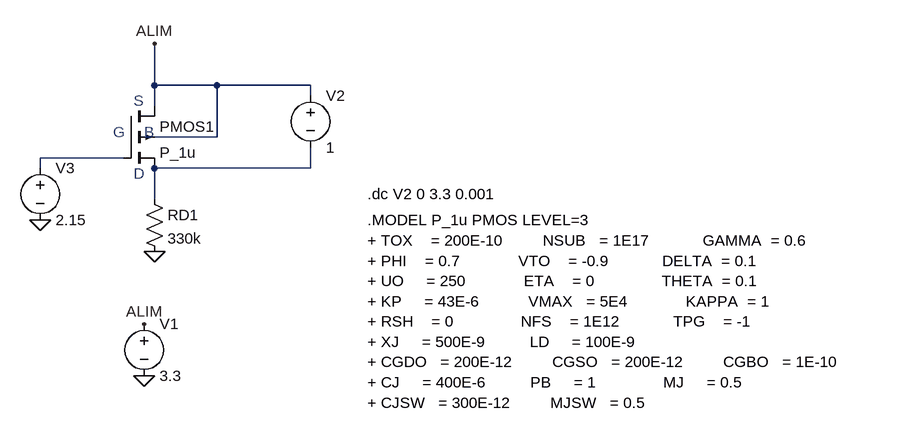
[diagram p0: schematic Simulation_gd.asc]
Simulation_gd.asc, the LTspice schematic file:
Version 4
SHEET 1 880 680
WIRE -336 -80 -336 -144
WIRE -240 -80 -336 -80
WIRE -96 -80 -240 -80
WIRE -96 -64 -96 -80
WIRE -336 -48 -336 -80
WIRE -240 0 -240 -80
WIRE -240 0 -336 0
WIRE -384 32 -512 32
WIRE -512 48 -512 32
WIRE -96 48 -96 16
WIRE -96 48 -336 48
WIRE -336 96 -336 48
FLAG -352 288 ALIM
FLAG -352 368 0
FLAG -336 176 0
FLAG -336 -144 ALIM
FLAG -512 128 0
SYMBOL voltage -352 272 R0
WINDOW 123 0 0 Left 0
WINDOW 39 0 0 Left 0
SYMATTR InstName V1
SYMATTR Value 3.3
SYMBOL pmos4 -384 -48 R0
SYMATTR InstName PMOS1
SYMATTR Value P_1u
SYMATTR Value2 l=1u w=2.5u
SYMBOL res -352 80 R0
SYMATTR InstName RD1
SYMATTR Value 330k
SYMBOL voltage -96 -80 R0
SYMATTR InstName V2
SYMATTR Value 1
SYMBOL voltage -512 32 R0
WINDOW 123 0 0 Left 0
WINDOW 39 0 0 Left 0
SYMATTR InstName V3
SYMATTR Value 2.15
TEXT -8 88 Left 2 !.dc V2 0 3.3 0.001
TEXT -368 -56 Left 2 ;S
TEXT -400 -8 Left 2 ;G
TEXT -352 -8 Left 2 ;B
TEXT -368 56 Left 2 ;D
TEXT -8 128 Left 2 !.MODEL P_1u PMOS LEVEL=3\n+ TOX    = 200E-10         NSUB   = 1E17            GAMMA  = 0.6          \n+ PHI    = 0.7             VTO    = -0.9            DELTA  = 0.1          \n+ UO     = 250             ETA    = 0               THETA  = 0.1         \n+ KP     = 43E-6           VMAX   = 5E4             KAPPA  = 1         \n+ RSH    = 0               NFS    = 1E12            TPG    = -1                 \n+ XJ     = 500E-9          LD     = 100E-9               \n+ CGDO   = 200E-12         CGSO   = 200E-12         CGBO   = 1E-10              \n+ CJ     = 400E-6          PB     = 1               MJ     = 0.5                \n+ CJSW   = 300E-12         MJSW   = 0.5

The netlist it stands for:
* Simulation_gd.asc
V1 ALIM 0 3.3
M§PMOS1 ALIM N001 N002 ALIM P_1u l=1u w=2.5u
RD1 N002 0 330k
V2 ALIM N002 1
V3 N001 0 2.15
.model NMOS NMOS
.model PMOS PMOS
.lib standard.mos
.dc V2 0 3.3 0.001
* S
* G
* B
* D
.MODEL P_1u PMOS LEVEL=3
+ TOX    = 200E-10         NSUB   = 1E17            GAMMA  = 0.6
+ PHI    = 0.7             VTO    = -0.9            DELTA  = 0.1
+ UO     = 250             ETA    = 0               THETA  = 0.1
+ KP     = 43E-6           VMAX   = 5E4             KAPPA  = 1
+ RSH    = 0               NFS    = 1E12            TPG    = -1
+ XJ     = 500E-9          LD     = 100E-9
+ CGDO   = 200E-12         CGSO   = 200E-12         CGBO   = 1E-10
+ CJ     = 400E-6          PB     = 1               MJ     = 0.5
+ CJSW   = 300E-12         MJSW   = 0.5
.backanno
.end